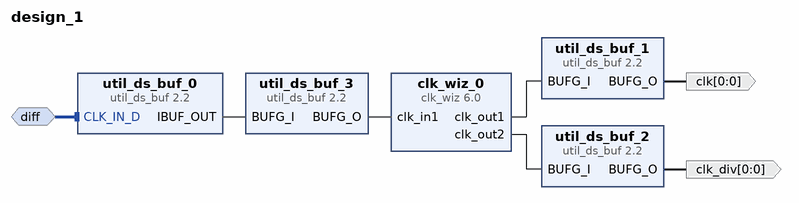
[diagram p0: block diagram of the top level]
# Vivado block design design_1, xc7a100tlfgg484-2L, Vivado 2022.1
create_bd_design design_1

create_bd_intf_port -mode Slave -vlnv xilinx.com:interface:diff_clock_rtl:1.0 diff
set_property -dict {CONFIG.FREQ_HZ 100000000} [get_bd_intf_ports diff]
create_bd_port -dir O -from 0 -to 0 clk
create_bd_port -dir O -from 0 -to 0 clk_div

create_bd_cell -type ip -vlnv xilinx.com:ip:util_ds_buf:2.2 util_ds_buf_0
set_property -dict {CONFIG.C_BUF_TYPE IBUFDSGTE} [get_bd_cells util_ds_buf_0]
create_bd_cell -type ip -vlnv xilinx.com:ip:clk_wiz:6.0 clk_wiz_0
set_property -dict [list \
  CONFIG.CLKOUT2_JITTER 175.402 \
  CONFIG.CLKOUT2_PHASE_ERROR 98.575 \
  CONFIG.CLKOUT2_REQUESTED_OUT_FREQ 25 \
  CONFIG.CLKOUT2_USED true \
  CONFIG.MMCM_CLKOUT1_DIVIDE 40 \
  CONFIG.NUM_OUT_CLKS 2 \
  CONFIG.USE_LOCKED false \
  CONFIG.USE_RESET false \
] [get_bd_cells clk_wiz_0]
create_bd_cell -type ip -vlnv xilinx.com:ip:util_ds_buf:2.2 util_ds_buf_1
set_property -dict {CONFIG.C_BUF_TYPE BUFG} [get_bd_cells util_ds_buf_1]
create_bd_cell -type ip -vlnv xilinx.com:ip:util_ds_buf:2.2 util_ds_buf_2
set_property -dict {CONFIG.C_BUF_TYPE BUFG} [get_bd_cells util_ds_buf_2]
create_bd_cell -type ip -vlnv xilinx.com:ip:util_ds_buf:2.2 util_ds_buf_3
set_property -dict {CONFIG.C_BUF_TYPE BUFG} [get_bd_cells util_ds_buf_3]

# ---- connections ----

connect_bd_intf_net -intf_net diff_clock_rtl_0_1 [get_bd_intf_ports diff] [get_bd_intf_pins util_ds_buf_0/CLK_IN_D]
connect_bd_net [get_bd_pins clk_wiz_0/clk_out1] [get_bd_pins util_ds_buf_1/BUFG_I]
connect_bd_net [get_bd_pins clk_wiz_0/clk_out2] [get_bd_pins util_ds_buf_2/BUFG_I]
connect_bd_net [get_bd_pins util_ds_buf_0/IBUF_OUT] [get_bd_pins util_ds_buf_3/BUFG_I]
connect_bd_net [get_bd_pins util_ds_buf_1/BUFG_O] [get_bd_ports clk]
connect_bd_net [get_bd_pins util_ds_buf_2/BUFG_O] [get_bd_ports clk_div]
connect_bd_net [get_bd_pins util_ds_buf_3/BUFG_O] [get_bd_pins clk_wiz_0/clk_in1]

validate_bd_design
save_bd_design
